# EAGLE schematic Schaltplan (EAGLE 9.6.2)
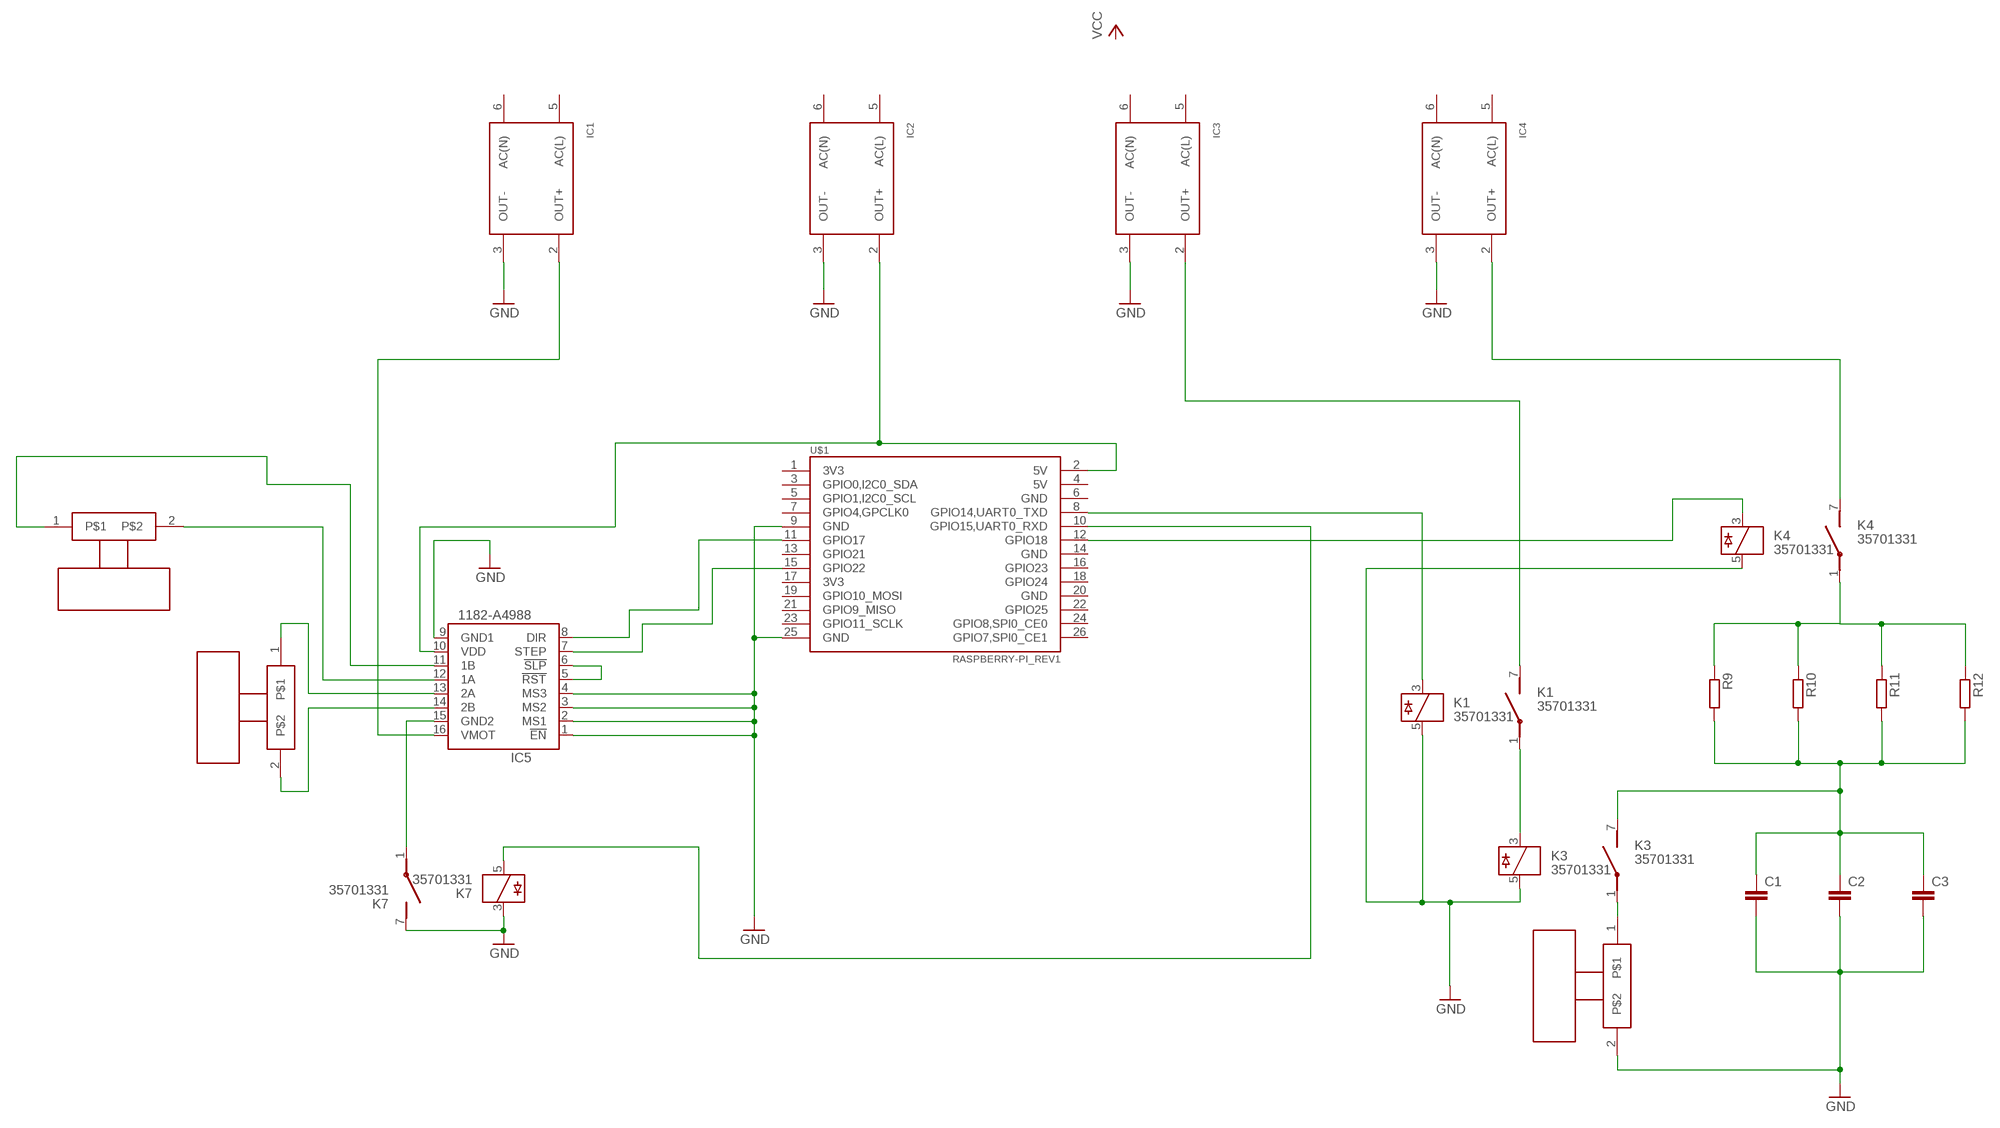
[diagram p0: schematic, sheet 1]

## Parts
C1  C-EU025-025X050  [C025-025X050]
C2  C-EU025-025X050  [C025-025X050]
C3  C-EU025-025X050  [C025-025X050]
IC1  TMLM04-SINGLE  [TMLM04]
IC2  TMLM04-SINGLE  [TMLM04]
IC3  TMLM04-SINGLE  [TMLM04]
IC4  TMLM04-SINGLE  [TMLM04]
IC5  1182-A4988  [A4988]
K1  35701331  [REED]
K3  35701331  [REED]
K4  35701331  [REED]
K7  35701331  [REED]
R9  R-EU_0204/7  [0204/7]
R10  R-EU_0204/7  [0204/7]
R11  R-EU_0204/7  [0204/7]
R12  R-EU_0204/7  [0204/7]
U$1  RASPBERRY-PI_REV1  [RASPBERRY-PI_REV1]
U$2  SOLENOID-VALVESOLENOID-CONNECTOR  [332-02]
U$3  SOLENOID-VALVESOLENOID-CONNECTOR  [332-02]
U$4  SOLENOID-VALVESOLENOID-CONNECTOR  [332-02]

## Nets
GND: C1.2 C2.2 C3.2 IC1.3(OUT-) IC2.3(OUT-) IC3.3(OUT-) IC4.3(OUT-) IC5.1(!EN) IC5.2(MS1) IC5.3(MS2) IC5.4(MS3) IC5.9(GND1) K1.5 K3.5 K4.5 K7.3 K7.7(2:S) U$1.9(GND) U$1.25(GND) U$2.2
N$1: IC4.2(OUT+) K4.7(2:S)
N$2: K4.1(2:P) R9.1 R10.1 R11.1 R12.1
N$3: C1.1 C2.1 C3.1 K3.7(2:S) R9.2 R10.2 R11.2 R12.2
N$4: IC1.2(OUT+) IC5.16(VMOT)
N$5: K3.1(2:P) U$2.1
N$6: IC5.15(GND2) K7.1(2:P)
N$7: IC2.2(OUT+) IC5.10(VDD) U$1.2(5V)
N$8: IC5.11(1B) U$3.1
N$9: IC5.12(1A) U$3.2
N$10: IC5.13(2A) U$4.1
N$11: IC5.14(2B) U$4.2
N$12: K1.3 U$1.8(GPIO14,UART0_TXD)
N$13: IC5.8(DIR) U$1.11(GPIO17)
N$14: IC5.7(STEP) U$1.15(GPIO22)
N$15: IC5.5(!RST) IC5.6(!SLP)
N$16: IC3.2(OUT+) K1.7(2:S)
N$17: K7.5 U$1.10(GPIO15,UART0_RXD)
N$18: K4.3 U$1.12(GPIO18)
N$19: K1.1(2:P) K3.3
Unconnected: IC1.5(AC(L)) IC1.6(AC(N)) IC2.5(AC(L)) IC2.6(AC(N)) IC3.5(AC(L)) IC3.6(AC(N)) IC4.5(AC(L)) IC4.6(AC(N)) U$1.1(3V3) U$1.3(GPIO0,I2C0_SDA) U$1.4(5V) U$1.5(GPIO1,I2C0_SCL) U$1.6(GND) U$1.7(GPIO4,GPCLK0) U$1.13(GPIO21) U$1.14(GND) U$1.16(GPIO23) U$1.17(3V3) U$1.18(GPIO24) U$1.19(GPIO10_MOSI) U$1.20(GND) U$1.21(GPIO9_MISO) U$1.22(GPIO25) U$1.23(GPIO11_SCLK) U$1.24(GPIO8,SPI0_CE0) U$1.26(GPIO7,SPI0_CE1)

## Library data of the parts
C1-C3 = rcl:C-EU: CAPACITOR, European symbol; SPICEPREFIX: C
IC1-IC4 = ac_dc:TMLM04-SINGLE
IC5 = pololu-stepper-driver:1182-A4988: A4988 Stepper Motor Driver Carrier #1182 A4988 Stepper Motor Driver Carrier <https://www.pololu.com/product/1182> in Japan, Suzaku Lab. Ltd. <https://suzakugiken.jp/> #1182 A4988ステッピングモータドライバ <https://szc.jp/po1182>
K1 K3 K4 K7 = relay:35701331: RELAY reed, 1 x norm. open with polarity; OC_FARNELL: unknown; OC_NEWARK: unknown
R9-R12 = rcl:R-EU_: RESISTOR, European symbol; SPICEPREFIX: R
U$1 = RaspberryPi:RASPBERRY-PI_REV1: Raspberry Pi Board <http://www.raspberrypi.org/> Jacques Lagnel V1.0 (beta) 2012 Mateusz Bawaj V1.1 (beta) 2012 Board dimension: Forum 3D model <http://www.raspberrypi.org/forum/general-discussion/mechanical-profile-3d-models?value=3d%20model&type=1&include=1&search=1&ret=all> The GPIO Connector (P1): http://elinux.org/RPi_Low-level_peripherals
U$2-U$4 = Solenoid-valve:SOLENOID-VALVE